# Altium schematic sheet MotorSurucu.SchDoc
size B
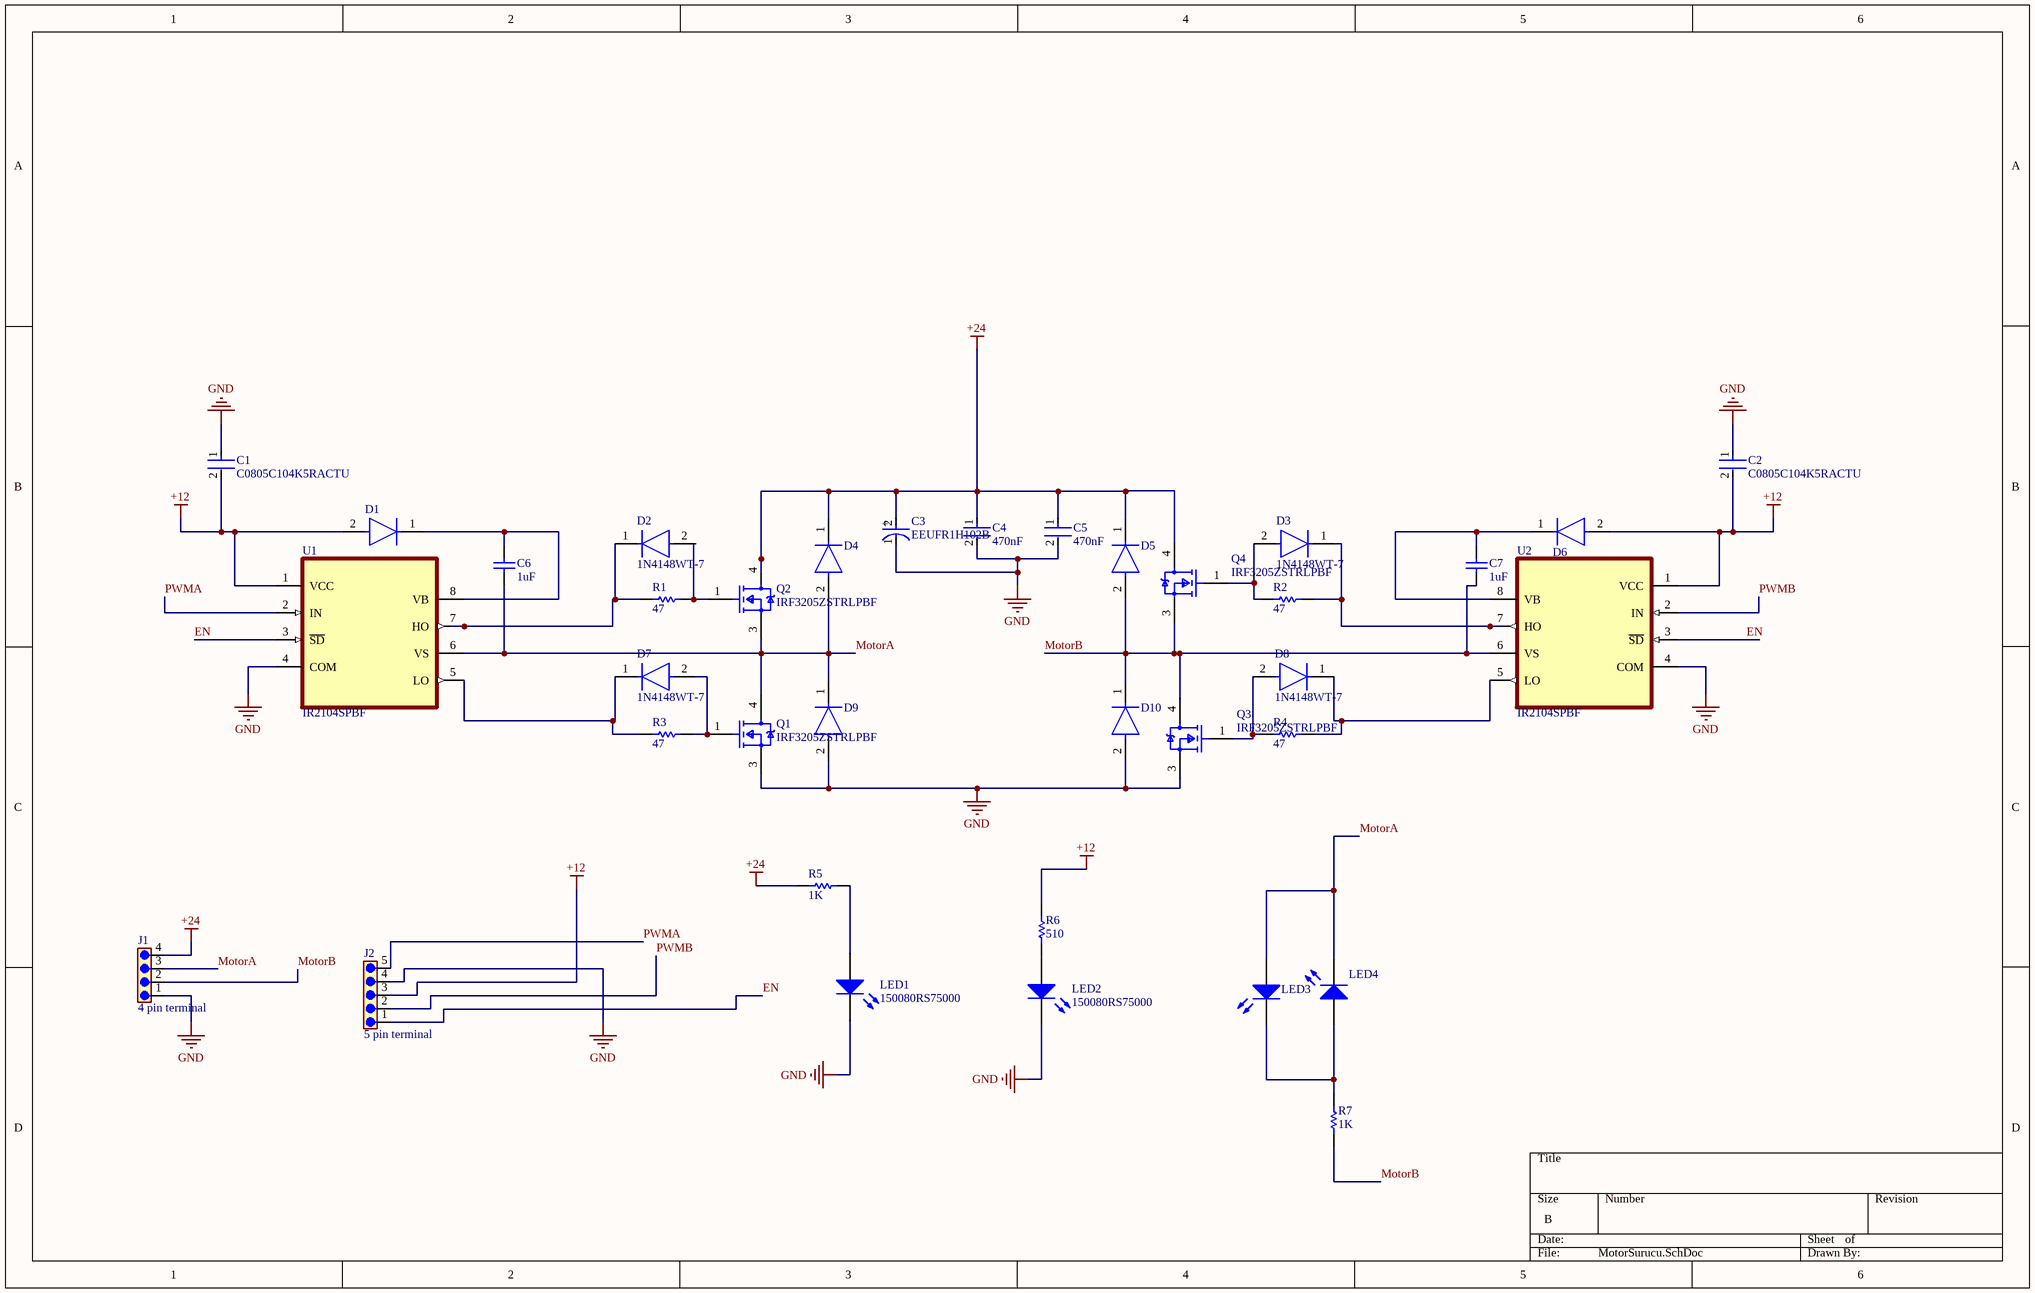
[diagram p0: MotorSurucu.SchDoc]

## Parts
C1  C0805C104K5RACTU  [FP-C0805C-DN-MFG]
C2  C0805C104K5RACTU  [FP-C0805C-DN-MFG]
C3  EEUFR1H102B  [FP-RAD-TH-D_16_0_5-L_25_2-MFG]
C4  470nF  [FP-C0805C-DN-MFG]
C5  470nF  [FP-C0805C-DN-MFG]
C6  1uF  [CAPC2013X135X45LL10T25]
C7  1uF  [CAPC2013X135X45LL10T25]
D1  1N5819HW1-7-F  [FP-SOD123F_Type_B-MFG]  (value not drawn)
D2  1N4148WT-7  [FP-SOD523-MFG]
D3  1N4148WT-7  [FP-SOD523-MFG]
D4  1N5819HW1-7-F  [FP-SOD123F_Type_B-MFG]  (value not drawn)
D5  1N5819HW1-7-F  [FP-SOD123F_Type_B-MFG]  (value not drawn)
D6  1N5819HW1-7-F  [FP-SOD123F_Type_B-MFG]  (value not drawn)
D7  1N4148WT-7  [FP-SOD523-MFG]
D8  1N4148WT-7  [FP-SOD523-MFG]
D9  1N5819HW1-7-F  [FP-SOD123F_Type_B-MFG]  (value not drawn)
D10  1N5819HW1-7-F  [FP-SOD123F_Type_B-MFG]  (value not drawn)
J1  4 pin terminal  [yesil klemens disi]
J2  5 pin terminal  [5li klemens disi]
LED1  150080RS75000  [0805_A]
LED2  150080RS75000  [0805_A]
LED3  150080BS75000  [0805_A]  (value not drawn)
LED4  150080BS75000  [0805_A]  (value not drawn)
Q1  IRF3205ZSTRLPBF  [FP-PG-TO263-3-MFG]
Q2  IRF3205ZSTRLPBF  [FP-PG-TO263-3-MFG]
Q3  IRF3205ZSTRLPBF  [FP-PG-TO263-3-MFG]
Q4  IRF3205ZSTRLPBF  [FP-PG-TO263-3-MFG]
R1  47  [RESC2013X70X40NL20T20]
R2  47  [RESC2013X70X40NL20T20]
R3  47  [RESC2013X70X40NL20T20]
R4  47  [RESC2013X70X40NL20T20]
R5  1K  [RESC2013X50X30NL20T20]
R6  510  [RESC2013X60X40LL20T25]
R7  1K  [RESC2013X50X30NL20T20]
U1  IR2104SPBF  [IR2104]
U2  IR2104SPBF  [IR2104]

## Nets
+12: C1.2 C2.2 D1.2(A) D6.2(A) J2.3 R6.1 U1.1(VCC) U2.1(VCC)
+24: C3.2(A) C4.1 C5.1 D4.1(C) D5.1(C) J1.4 Q2.4(D) Q4.4(D) R5.1
GND: C1.1 C2.1 C3.1(C) C4.2 C5.2 D9.2(A) D10.2(A) J1.1 J2.4 LED1.1(K) LED2.1(K) Q1.3(S) Q3.3(S) U1.4(COM) U2.4(COM)
EN: J2.1 U1.3(~{SD}) U2.3(~{SD})
MotorA: C6.1 D4.2(A) D9.1(C) J1.3 LED3.2(A) LED4.1(K) Q1.4(D) Q2.3(S) U1.6(VS)
MotorB: C7.1 D5.2(A) D10.1(C) J1.2 Q3.4(D) Q4.3(S) R7.1 U2.6(VS)
PWMA: J2.5 U1.2(IN)
PWMB: J2.2 U2.2(IN)
NetC6_2: C6.2 D1.1(C) U1.8(VB)
NetC7_2: C7.2 D6.1(C) U2.8(VB)
NetD2_1: D2.1(C) R1.1 U1.7(HO)
NetD2_2: D2.2(A) Q2.1(G) R1.2
NetD3_1: D3.1(C) R2.2 U2.7(HO)
NetD3_2: D3.2(A) Q4.1(G) R2.1
NetD7_1: D7.1(C) R3.1 U1.5(LO)
NetD7_2: D7.2(A) Q1.1(G) R3.2
NetD8_1: D8.1(C) R4.2 U2.5(LO)
NetD8_2: D8.2(A) Q3.1(G) R4.1
NetLED1_2: LED1.2(A) R5.2
NetLED2_2: LED2.2(A) R6.2
NetLED3_1: LED3.1(K) LED4.2(A) R7.2

## Notes on the sheet
- (in symbol CMP-05427-000487-1) +

## Library data of the parts
C1 C2 = CMP-2007-00279-2: CAP CER 0.1UF 50V X7R 0805; Manufacturer: KEMET; Value: 0.10 μF; Tolerance: 0.1; Temperature Coefficient: 30ppm/°C; Material: Ceramic; Manufacturer Part Number: C0805C104K5RACTU; Device Class L2: Capacitors; Temperature Range Low: -55°C; Voltage Rating: 50 V; Digikey Description: CAP CER 0.1UF 50V X7R 0805; Category: Cap; ComponentLink2Description: Datasheet; Octopart: https://octopart.com/c0805c104k5ractu-kemet-143926; RoHS: TRUE; ComponentLink2URL: https://content.kemet.com/datasheets/KEM_C1003_C0G_SMD.pdf; Temperature Characteristic: X7R; Temperature: -55°C to +125°C; Height: 0.88mm; Temperature Range High: +125°C; Device Class L1: Passive Components; Automotive: No; Lead Free: Yes; Ipc Land Pattern Name: CAPC200125X78; Device Class L3: Ceramic Capacitors; Mouser Description: Cap Ceramic 0.1uF 50V X7R 10% SMD 2.0 x 1.2 mm 125 C Paper T/R; Capacitance: 0.10 μF; Package: C0805C-DN
C3 = CMP-05427-000487-1: Aluminum Electrolytic Capacitors (Radial Lead Type) 1000uF ±20% 50V; Ripple Current: 3.32A; Impedance: 16mR; Polarity: Polar; Life (Hours): 10000Hour; Capacitance: 1mF; Lead Diameter: 0.8mm; Mount: Through Hole; Series: FR; Package Quantity: 250; Length: 25mm; Radiation Hardening: No; REACH SVHC: No SVHC; Case/Package: Radial; Height: 25mm; Min Operating Temperature: -40°C; Contact Plating: Tin; Lead Free: Lead Free; Height - Seated (Max): 0.984inch; RoHS Compliant: Yes; Features: General Purpose; ESR (Equivalent Series Resistance): 16mR; Voltage Rating: 50V; Diameter: 16mm; Voltage Rating (DC): 50V; Max Operating Temperature: 105°C; Lead Pitch: 7.5mm; Packaging: Tape and Reel; Number of Pins: 2; Tolerance: 20%; Termination: Through Hole
C4 C5 = CMP-2007-03659-2: CAP CER 0.47UF 50V 10% X7R 0805 C0805C474K5RACTU; Manufacturer: KEMET; Capacitance: 0.47 μF; Temperature Coefficient: 30ppm/°C; Value: 0.47 μF; Tolerance: 0.1; Material: Ceramic; ComponentLink2Description: Datasheet; RoHS: TRUE; Digikey Description: CAP CER 0.47UF 50V 10% X7R 0805; Temperature: -55°C to +125°C; Temperature Range Low: -55°C; Temperature Range High: +125°C; Manufacturer Part Number: C0805C474K5RACTU; Temperature Characteristic: X7R; Height: 0.88mm; Octopart: https://octopart.com/c0805c474k5ractu-kemet-144543; Mouser Description: 0805 C 470nF Ceramic Multilayer Capacitor, 50 VDC, +125degC, X7R Dielec, +/-10%; Device Class L2: Capacitors; Voltage Rating: 50 V; ComponentLink2URL: https://content.kemet.com/datasheets/KEM_C1003_C0G_SMD.pdf; Package: C0805C-DN; Ipc Land Pattern Name: CAPC200125X78; Automotive: No; Device Class L1: Passive Components; Device Class L3: Ceramic Capacitors; Category: Cap; Lead Free: Yes
C6 = CMP-1036-04761-2: GRM21BR71H105KA12L; Manufacturer: Murata; Part Number: GRM21BR71H105KA12L
C7 = CMP-1036-04761-2: GRM21BR71H105KA12L    0805; Manufacturer: Murata; Part Number: GRM21BR71H105KA12L
D1 D4-D6 D9 D10 = CMP-12791-000028-1: DIODE SBR 40V 1A SOD123F; Manufacturer: Diodes Inc.; Max Junction Temp: +125°C; Capacitance: 30pF; Value: 30pF; Peak Reverse Current: 0.5mA; Max Surge Forward Current: 30A; ComponentLink2Description: Datasheet; Temperature: -55°C to +125°C; Lead Free: Yes; Package: SOD123F (Type B); Reverse Voltage: 40V; Device Class L2: Diodes; Manufacturer Part Number: 1N5819HW1-7-F; ComponentLink2URL: https://www.diodes.com/assets/Datasheets/1N5819HW1.pdf; Automotive: No; RoHS: TRUE; Height: 1.15mm; Digikey Description: DIODE SBR 40V 1A SOD123F; Max Repetitive Reverse Voltage: 40V; Forward Current: 1A; Footprint Url: https://www.diodes.com/assets/Package-Files/SOD123F%20(Type%20B).pdf; Temperature Range High: +125°C; Octopart: https://octopart.com/1n5819hw1-7-f-diodes+inc.-67250096; Mouser Description: Schottky Diodes & Rectifiers 1A SBR 40Vrrm 0.51Vf 0.5mA 28Vrms; Device Class L3: Rectifier Diodes; Ipc Land Pattern Name: SOD350180X98-2; Device Class L1: Discrete Semiconductors; Category: Diode; Temperature Range Low: -55°C
D2 D3 D7 D8 = CMP-2000-05518-3: DIODE GEN PURP 80V 125MA SOD523; Power Rating: 150mW; Peak Non-Repetitive Surge Current: 2A; Forward Voltage: 1.25V; Reverse Recovery Time: 4ns; Peak Reverse Current: 1uA; Max Repetitive Reverse Voltage (Vrrm): 100V; Capacitance: 2pF; Polarity: Standard; Element Configuration: Single; Forward Current: 250mA; Lead Free: Lead Free; Packaging: Tape and Reel; Length: 0.9mm; Min Operating Temperature: -65°C; Current Rating: 125mA; Max Reverse Voltage (DC): 80V; Width: 1.3mm; Package Quantity: 3000; Output Current: 125mA; Power Dissipation: 150mW; Max Operating Temperature: 150°C; Radiation Hardening: No; Average Rectified Current: 125mA; Height: 0.65mm; Voltage Rating (DC): 80V; Max Surge Current: 2A; Weight: 3.5E-05oz; Recovery Time: 4ns; Max Forward Surge Current (Ifsm): 2A; Contact Plating: Tin; Number of Pins: 2; Mount: Surface Mount; REACH SVHC: No SVHC
J1 = yesil klemens disi: WR-TBL SERIES 3055_5.08 MM_PCB H; MF: WÃ¼rth Elektronik; MP: 691305530004; SnapEDA_Link: https://www.snapeda.com/parts/691305530004/Wurth+Electronics+Inc./view-part/?ref=snap; Package: None; Value: *; Check_prices: https://www.snapeda.com/parts/691305530004/Wurth+Electronics+Inc./view-part/?ref=eda
J2 = 5li klemens disi
LED1 LED2 = CMP-1426-00011-1: SMD mono-color Chip LED, WL-SMCW, Red; Manufacturer: Wuerth Elektronik; Color: Red; PartNumber: 150080RS75000; PackageReference: 0805_A; ComponentLink2Description: Datasheet; ComponentLink1URL: http://www.we-online.com; ComponentLink1Description: Manufacturer URL; ComponentLink2URL: http://katalog.we-online.com/led/datasheet/150080RS75000.pdf
LED3 LED4 = CMP-1426-00008-1: SMD mono-color Chip LED, WL-SMCW, Blue; Manufacturer: Wuerth Elektronik; Color: Blue; ComponentLink2URL: http://katalog.we-online.com/led/datasheet/150080BS75000.pdf; ComponentLink1URL: http://www.we-online.com; ComponentLink2Description: Datasheet; PackageReference: 0805_A; ComponentLink1Description: Manufacturer URL; PartNumber: 150080BS75000
Q1-Q4 = CMP-32901-000456-1: MOSFET N-CH 55V 75A D2PAK; Power Dissipation: 170W; Gate to Source Voltage (Vgs): 20V; Input Capacitance: 3.45nF; Drain to Source Resistance: 6.5mR; Turn-On Delay Time: 18ns; Element Configuration: Single; Turn-Off Delay Time: 45ns; Packaging: Tape and Reel; RoHS Compliant: Yes; Case/Package: D2PAK; Length: 0.42inch; Mount: Surface Mount; Max Dual Supply Voltage: 55V; Drain to Source Voltage (Vdss): 55V; Height: 0.19inch; Max Operating Temperature: 175°C; Width: 0.38inch; Halogen Free: Halogen Free; Lead Free: Contains Lead; Number of Pins: 3; Continuous Drain Current (ID): 75A; Max Power Dissipation: 170W; Rds On Max: 6.5mR; Min Operating Temperature: -55°C
R1-R4 = CMP-2001-00205-1: ERJ6ENF47R0V; Manufacturer: Panasonic; Part Number: ERJ6ENF47R0V
R5 R7 = CMP-1013-00510-2: CRCW08051K00FKEA; Manufacturer: Vishay Dale; Part Number: CRCW08051K00FKEA
R6 = CMP-2001-00648-1: Manufacturer: Panasonic; Part Number: ERA6AEB511V
U1 U2 = IR2104